# Altium schematic sheet 外围.SchDoc
size A4; SheetNumber: 3; SheetTotal: 7
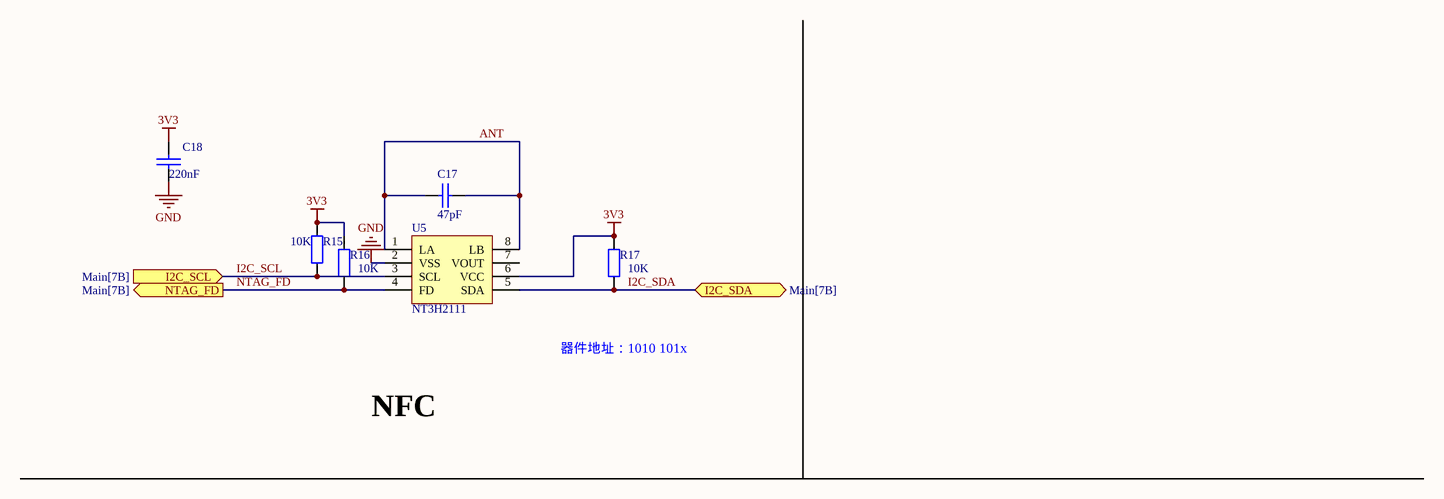
[diagram p0: 外围.SchDoc]

## Parts
C17  47pF  [0402_C]
C18  220nF  [0201_C]
R15  value 10K  [0201_R]  (hidden comment: Res)
R16  value 10K  [0201_R]  (hidden comment: Res)
R17  value 10K  [0201_R]  (hidden comment: Res)
U5  NT3H2111  [TSSOP-8]

## Ports
I2C_SCL (in, see Main[7B]), I2C_SDA (bidir, see Main[7B]), NTAG_FD (out, see Main[7B])

## Nets
3V3: C18.1 R15.1 R16.1 R17.1 U5.6(VCC)
GND: C18.2 U5.2(VSS)
ANT: C17.1 C17.2 U5.1(LA) U5.8(LB)
I2C_SCL: R15.2 U5.3(SCL) ; port I2C_SCL
I2C_SDA: R17.2 U5.5(SDA) ; port I2C_SDA
NTAG_FD: R16.2 U5.4(FD) ; port NTAG_FD

Not connected (* = marked no-connect by the designer): U5 7(VOUT)

## Notes on the sheet
- 器件地址：1010 101x
- NFC

## Library data of the parts
C17 C18 = CAP: Capacitor
  C17: Value: 47pF
  C18: Value: 220nF
R15-R17 = Res2: Resistor
U5 = NT3H1101